# EAGLE schematic rs485 (EAGLE 6.6.0)
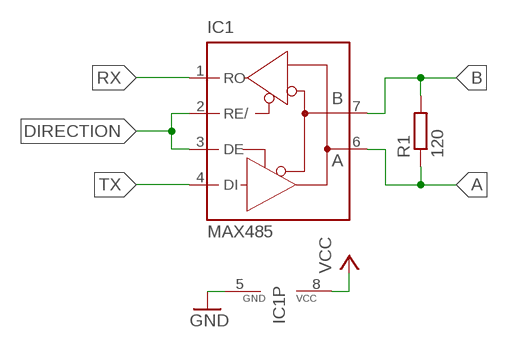
[diagram p0: schematic, sheet 1]

## Parts
IC1  MAX485  MAX481CPA  [DIL08]
R1  120  R-EU_0207/2V  [0207/2V]

## Nets
A: IC1.6(A) R1.1
B: IC1.7(B) R1.2
DIRECTION: IC1.2(RE/) IC1.3(DE)
GND: IC1.5(GND)
RX: IC1.1(RO)
TX: IC1.4(DI)
VCC: IC1.8(VCC)

## Library data of the parts
IC1 = maxim:MAX481CPA: RS485 TRANSEIVER; MPN: MAX481CPA+; OC_FARNELL: unknown; OC_NEWARK: 99K3445
R1 = rcl:R-EU_: RESISTOR, European symbol